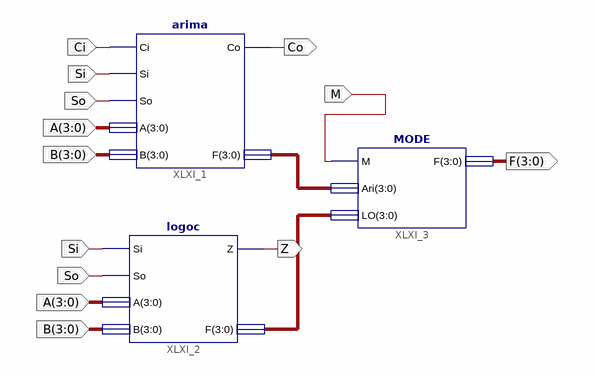
[diagram p0: schematic sheet 1]
// Xilinx ISE schematic A.sch (xc9500xl) as structural Verilog: 3 symbols, 9 ports
module A (
  input  Ci,
  input  Si,
  input  So,
  input  [3:0] A,
  input  [3:0] B,
  input  M,
  output Z,
  output Co,
  output [3:0] F
);

  wire [3:0] XLXN_1, XLXN_2;

  arima XLXI_1 (.Ci(Ci), .Si(Si), .So(So), .A(A), .B(B), .Co(Co), .F(XLXN_1));
  logoc XLXI_2 (.Si(Si), .So(So), .A(A), .B(B), .Z(Z), .F(XLXN_2));
  MODE XLXI_3 (.M(M), .Ari(XLXN_1), .LO(XLXN_2), .F(F));
endmodule
